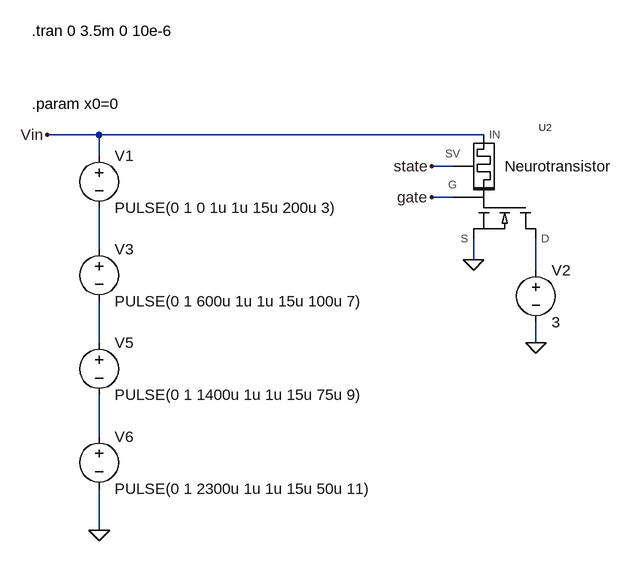
[diagram p0: schematic Neurotransistor_sim.asc]
Neurotransistor_sim.asc, the LTspice schematic file:
Version 4
SHEET 1 1728 2052
WIRE -80 256 -160 256
WIRE 512 256 -80 256
WIRE -80 288 -80 256
WIRE 464 304 432 304
WIRE 464 352 432 352
WIRE -80 432 -80 368
WIRE 496 448 496 416
WIRE 592 464 592 416
WIRE -80 576 -80 512
WIRE 592 576 592 544
WIRE -80 720 -80 656
WIRE -80 864 -80 800
FLAG -160 256 Vin
FLAG -80 864 0
FLAG 496 448 0
FLAG 432 304 state
FLAG 432 352 gate
FLAG 592 576 0
SYMBOL voltage -80 272 R0
WINDOW 123 0 0 Left 0
WINDOW 39 0 0 Left 0
SYMATTR InstName V1
SYMATTR Value PULSE(0 1 0 1u 1u 15u 200u 3)
SYMBOL voltage -80 416 R0
WINDOW 123 0 0 Left 0
WINDOW 39 0 0 Left 0
SYMATTR InstName V3
SYMATTR Value PULSE(0 1 600u 1u 1u 15u 100u 7)
SYMBOL voltage -80 560 R0
WINDOW 123 0 0 Left 0
WINDOW 39 0 0 Left 0
SYMATTR InstName V5
SYMATTR Value PULSE(0 1 1400u 1u 1u 15u 75u 9)
SYMBOL voltage -80 704 R0
WINDOW 123 0 0 Left 0
WINDOW 39 0 0 Left 0
SYMATTR InstName V6
SYMATTR Value PULSE(0 1 2300u 1u 1u 15u 50u 11)
SYMBOL voltage 592 448 R0
WINDOW 123 0 0 Left 0
WINDOW 39 0 0 Left 0
SYMATTR InstName V2
SYMATTR Value 3
SYMBOL neurotransistor 496 256 R0
SYMATTR InstName U2
TEXT -184 96 Left 2 !.tran 0 3.5m 0 10e-6
TEXT -184 208 Left 2 !.param x0=0

The netlist it stands for:
* Neurotransistor_sim.asc
V1 Vin N001 PULSE(0 1 0 1u 1u 15u 200u 3)
V3 N001 N003 PULSE(0 1 600u 1u 1u 15u 100u 7)
V5 N003 N004 PULSE(0 1 1400u 1u 1u 15u 75u 9)
V6 N004 0 PULSE(0 1 2300u 1u 1u 15u 50u 11)
V2 N002 0 3
XU2 Vin N002 0 gate state neurotransistor Neurotransistor  ; pins IN D S G SV
.tran 0 3.5m 0 10e-6
.param x0=0
.lib neurotransistor.sub
.backanno
.end